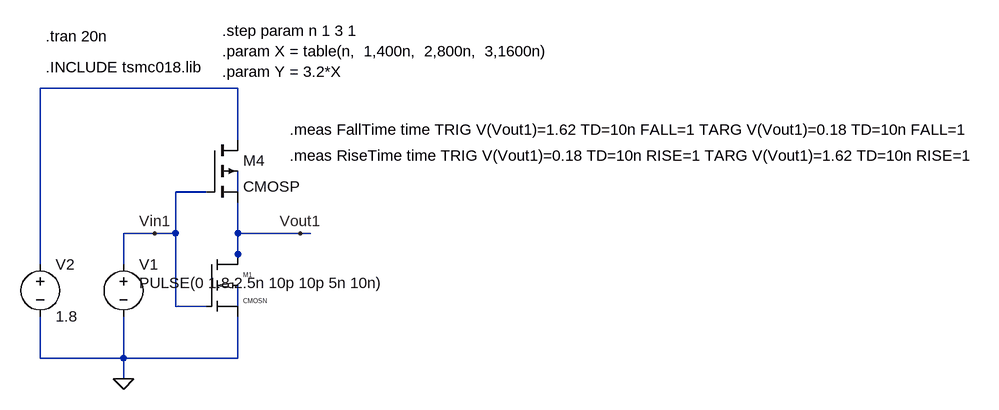
[diagram p0: schematic VTC_AC_WITHOUT_C.asc]
VTC_AC_WITHOUT_C.asc, the LTspice schematic file:
Version 4
SHEET 1 2184 1940
WIRE -528 -64 -832 -64
WIRE -528 16 -528 -64
WIRE -576 96 -624 96
WIRE -528 96 -528 64
WIRE -656 160 -704 160
WIRE -624 160 -624 96
WIRE -624 160 -656 160
WIRE -528 160 -528 112
WIRE -432 160 -528 160
WIRE -416 160 -432 160
WIRE -528 192 -528 160
WIRE -832 208 -832 -64
WIRE -704 208 -704 160
WIRE -528 208 -528 192
WIRE -624 272 -624 160
WIRE -576 272 -624 272
WIRE -528 272 -528 240
WIRE -832 352 -832 288
WIRE -704 352 -704 288
WIRE -704 352 -832 352
WIRE -528 352 -528 288
WIRE -528 352 -704 352
WIRE -704 384 -704 352
FLAG -704 384 0
FLAG -656 160 Vin1
FLAG -432 160 Vout1
DATAFLAG -624 96 ""
SYMBOL voltage -704 192 R0
WINDOW 123 0 0 Left 0
WINDOW 39 0 0 Left 0
WINDOW 3 24 44 Left 2
SYMATTR Value PULSE(0 1.8 2.5n 10p 10p 5n 10n)
SYMATTR InstName V1
SYMBOL voltage -832 192 R0
WINDOW 123 0 0 Left 0
WINDOW 39 0 0 Left 0
SYMATTR InstName V2
SYMATTR Value 1.8
SYMBOL cmosn -576 192 R0
SYMATTR InstName M1
SYMATTR Value2 l=180n w=X
SYMBOL cmosp -576 16 R0
SYMATTR InstName M4
SYMATTR Value2 l=180n w=Y
TEXT -824 -96 Left 2 !.INCLUDE tsmc018.lib
TEXT -824 -144 Left 2 !.tran 20n
TEXT -552 -152 Left 2 !.step param n 1 3 1\n.param X = table(n,  1,400n,  2,800n,  3,1600n)\n.param Y = 3.2*X
TEXT -448 0 Left 2 !.meas FallTime time TRIG V(Vout1)=1.62 TD=10n FALL=1 TARG V(Vout1)=0.18 TD=10n FALL=1
TEXT -448 40 Left 2 !.meas RiseTime time TRIG V(Vout1)=0.18 TD=10n RISE=1 TARG V(Vout1)=1.62 TD=10n RISE=1

The netlist it stands for:
* VTC_AC_WITHOUT_C.asc
V1 Vin1 0 PULSE(0 1.8 2.5n 10p 10p 5n 10n)
V2 N001 0 1.8
M1 Vout1 Vin1 0 N003 CMOSN l=180n w=X
M4 N001 Vin1 Vout1 N002 CMOSP l=180n w=Y
.model NMOS NMOS
.model PMOS PMOS
.lib standard.mos
.INCLUDE tsmc018.lib
.tran 20n
.step param n 1 3 1
.param X = table(n,  1,400n,  2,800n,  3,1600n)
.param Y = 3.2*X
.meas FallTime time TRIG V(Vout1)=1.62 TD=10n FALL=1 TARG V(Vout1)=0.18 TD=10n FALL=1
.meas RiseTime time TRIG V(Vout1)=0.18 TD=10n RISE=1 TARG V(Vout1)=1.62 TD=10n RISE=1
.lib tsmc018.lib
.backanno
.end

* Results of the author's LTspice run, read from the files saved beside the schematic
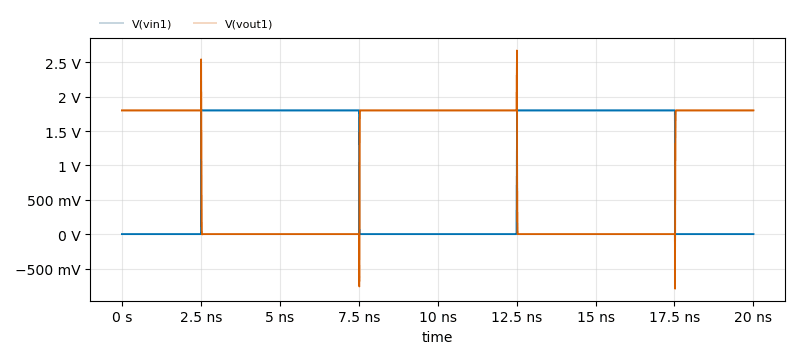
[diagram p1: Transient Analysis of VTC_AC_WITHOUT_C.asc, plotted from the saved traces]
* Transient Analysis, 3 runs:
*   V(vin1) [n=1]: min 0 V, max 1.8 V, average 901.8 mV, rms 1.274 V, last 0 V
*   V(vin1) [n=2]: min 0 V, max 1.8 V, average 901.8 mV, rms 1.274 V, last 0 V
*   V(vin1) [n=3]: min 0 V, max 1.8 V, average 901.8 mV, rms 1.274 V, last 0 V
*   V(vout1) [n=1]: min -697.2 mV, max 2.571 V, average 898.5 mV, rms 1.272 V, last 1.8 V
*   V(vout1) [n=2]: min -764.3 mV, max 2.642 V, average 898.7 mV, rms 1.273 V, last 1.8 V
*   V(vout1) [n=3]: min -794.3 mV, max 2.674 V, average 898.8 mV, rms 1.273 V, last 1.8 V
* From the log:
*   Measurement: falltime
*     step  falltime  FROM  TO
*        1  9.11531e-012  1.25138e-008  1.25229e-008
*        2  1.02313e-011  1.25147e-008  1.2525e-008
*        3  9.22168e-012  1.25153e-008  1.25245e-008
*   Measurement: risetime
*     step  risetime  FROM  TO
*        1  9.33414e-012  1.75226e-008  1.7532e-008
*        2  8.6279e-012  1.75229e-008  1.75315e-008
*        3  8.34284e-012  1.7523e-008  1.75314e-008